# Altium schematic sheet 通讯转换模块-V6.SchDoc
size 635 x 635 mm
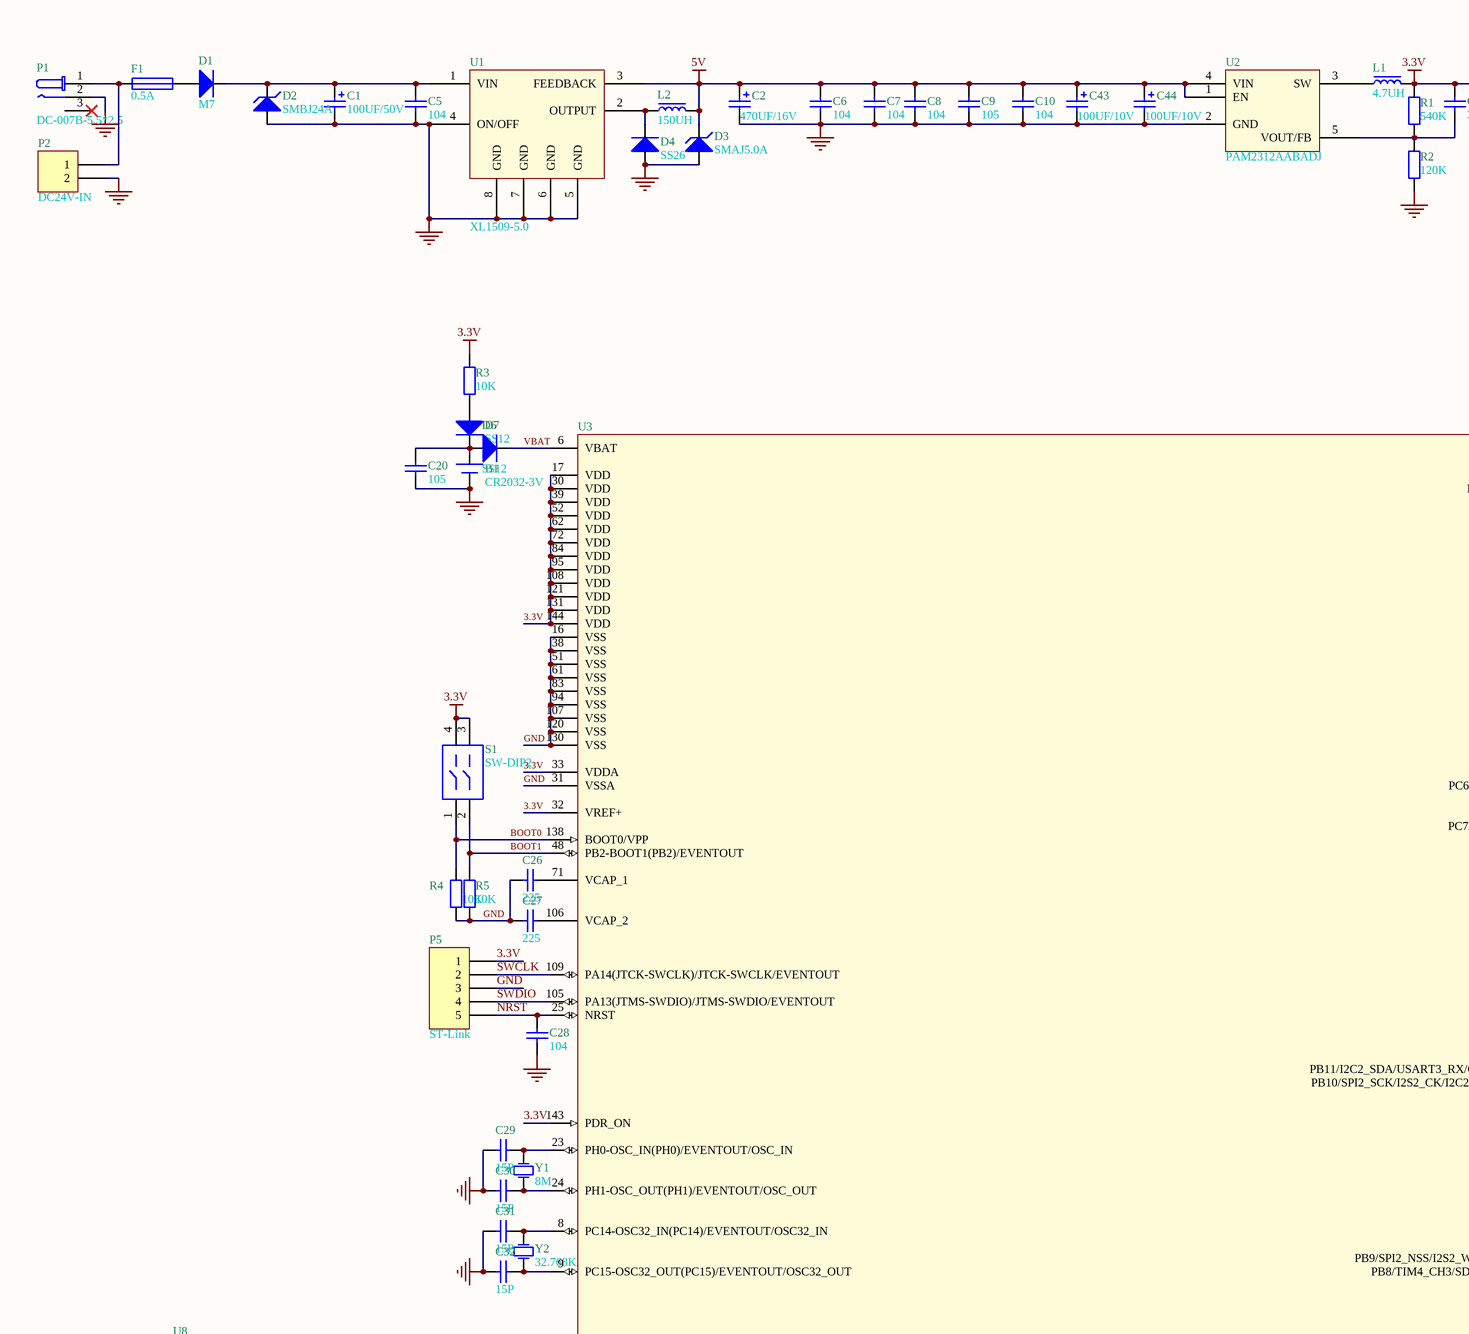
[diagram p0: 通讯转换模块-V6.SchDoc, top left]
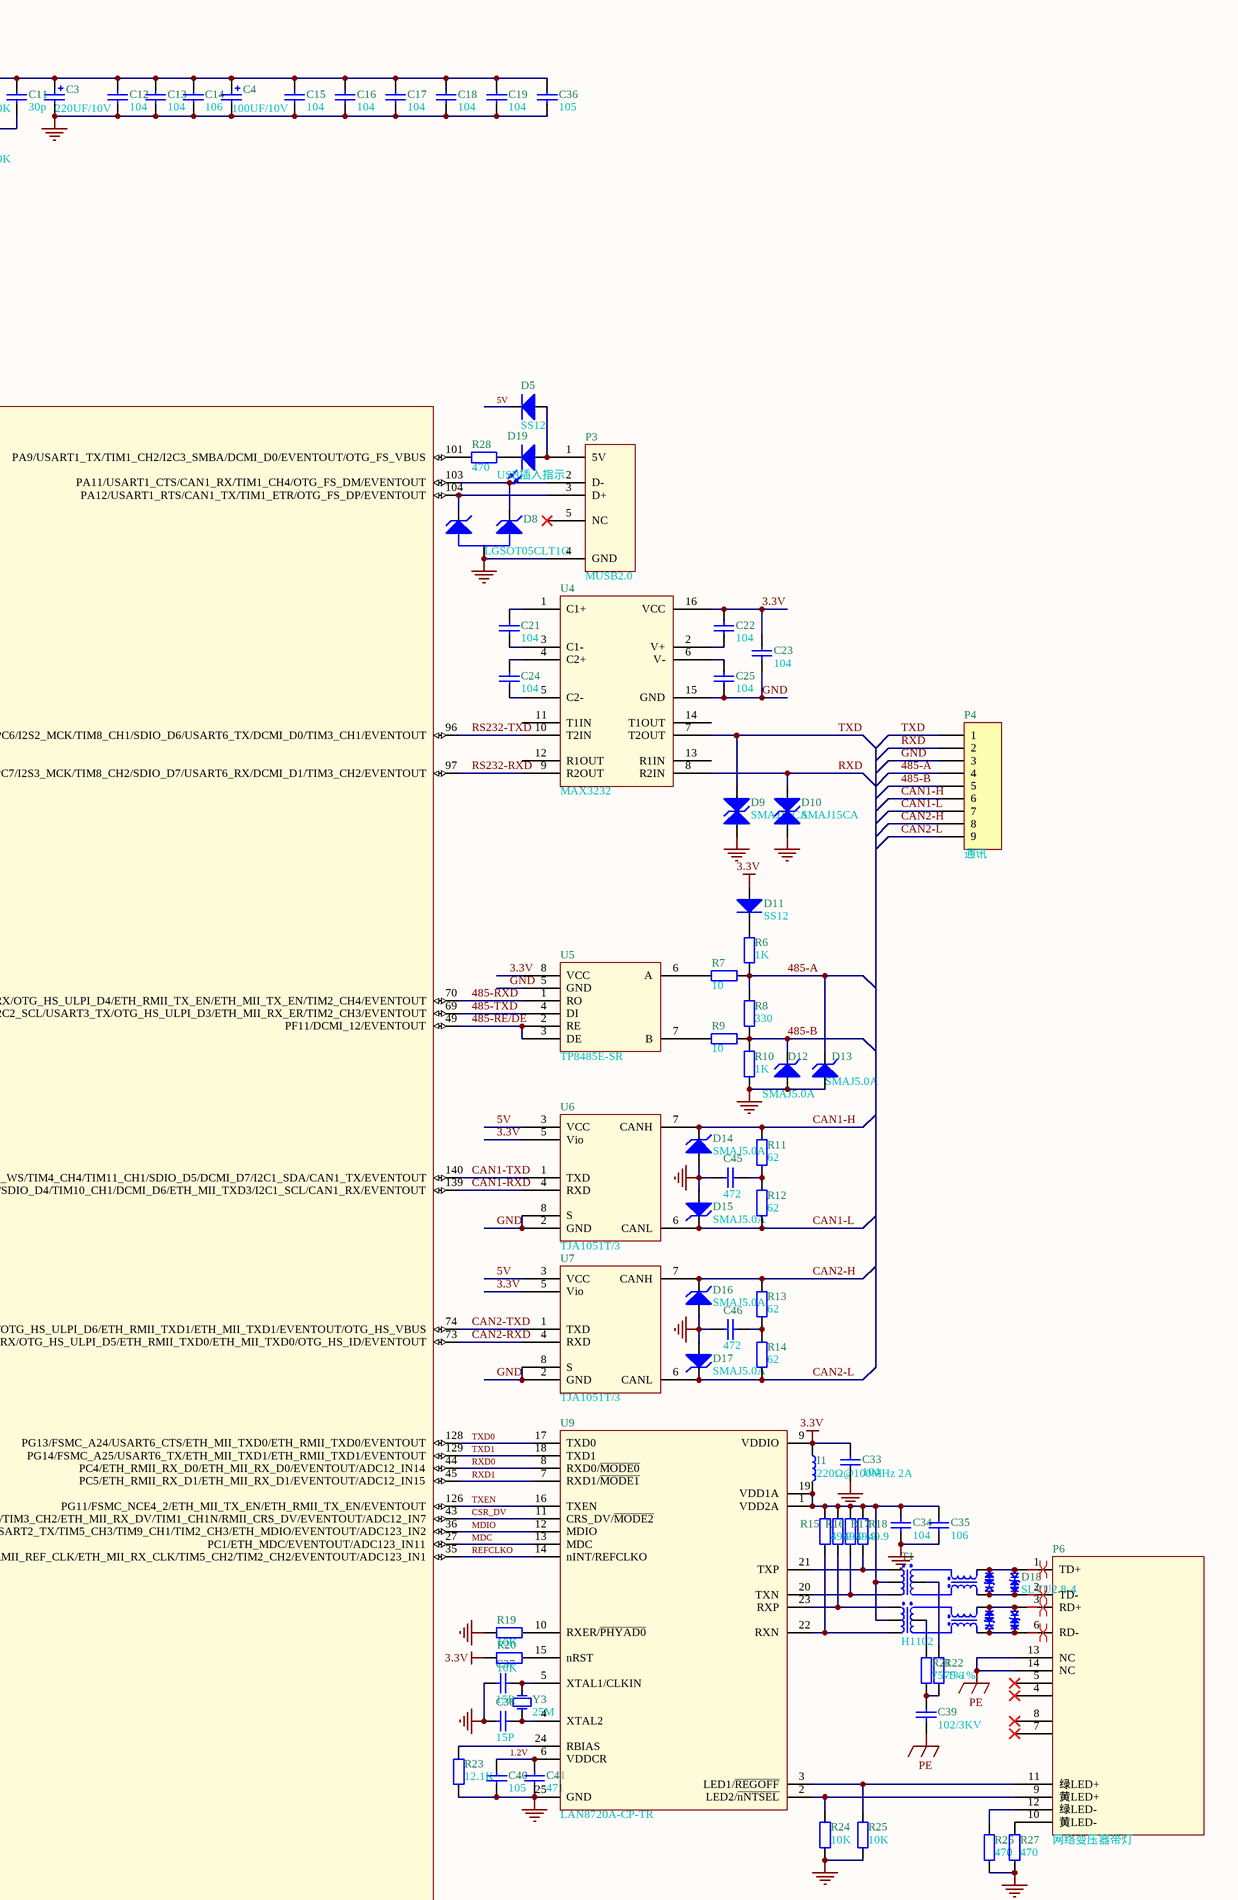
[diagram p1: 通讯转换模块-V6.SchDoc, top right]
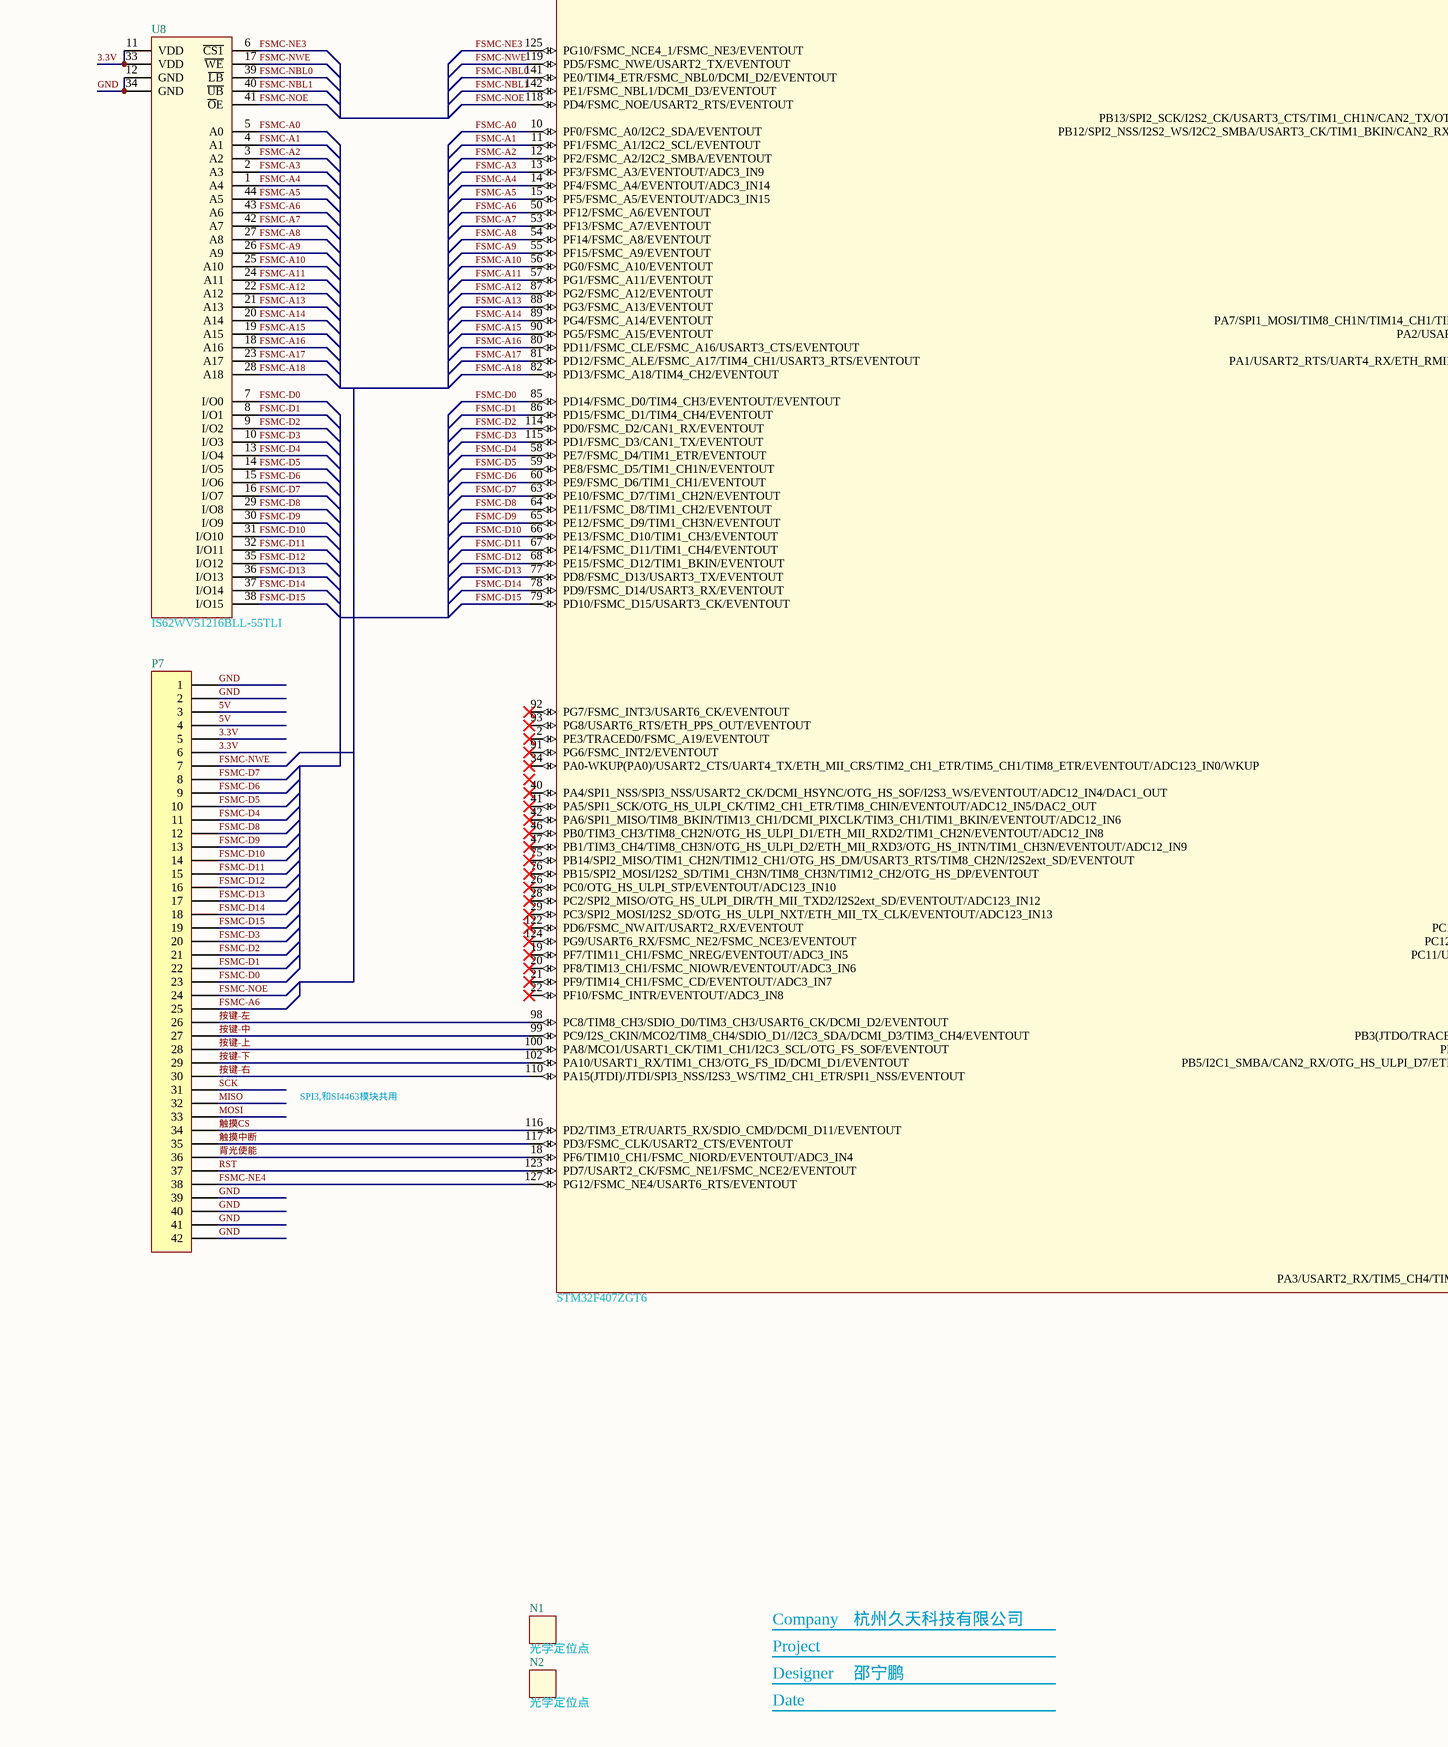
[diagram p2: 通讯转换模块-V6.SchDoc, bottom left]
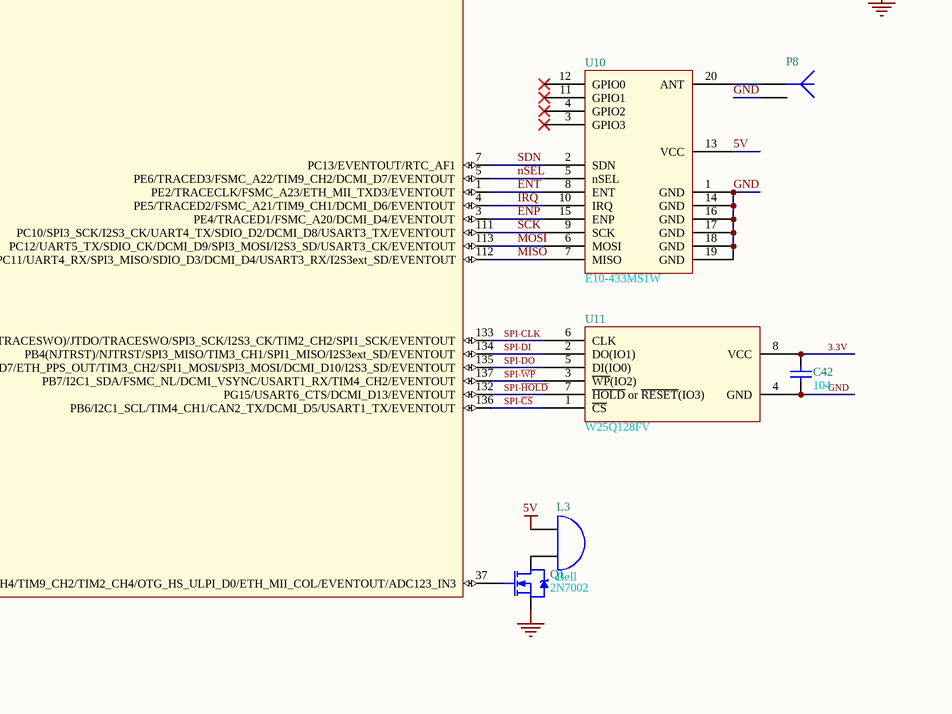
[diagram p3: 通讯转换模块-V6.SchDoc, bottom right]

## Parts
B1  CR2032-3V  [CR2032电池座-立式]
C1  100UF/50V  [贴片固态电容8*10]
C2  470UF/16V  [贴片固态电容8*10]
C3  220UF/10V  [贴片固态电容6.3*7.7]
C4  100UF/10V  [贴片固态电容5*5.3]
C5  104  [C-0603]
C6  104  [C-0603]
C7  104  [C-0603]
C8  104  [C-0603]
C9  105  [C-0603]
C10  104  [C-0603]
C11  30p  [C-0603]
C12  104  [C-0603]
C13  104  [C-0603]
C14  106  [C-0603]
C15  104  [C-0603]
C16  104  [C-0603]
C17  104  [C-0603]
C18  104  [C-0603]
C19  104  [C-0603]
C20  105  [C-0603]
C21  104  [C-0603]
C22  104  [C-0603]
C23  104  [C-0603]
C24  104  [C-0603]
C25  104  [C-0603]
C26  225  [C-0603]
C27  225  [C-0603]
C28  104  [C-0603]
C29  15P  [C-0603]
C30  15P  [C-0603]
C31  15P  [C-0603]
C32  15P  [C-0603]
C33  104  [C-0603]
C34  104  [C-0603]
C35  106  [C-0603]
C36  105  [C-0603]
C37  15P  [C-0603]
C38  15P  [C-0603]
C39  102/3KV  [C-1206]
C40  105  [C-0603]
C41  471  [C-0603]
C42  104  [C-0603]
C43  100UF/10V  [贴片固态电容5*5.3]
C44  100UF/10V  [贴片固态电容5*5.3]
C45  472  [C-0603]
C46  472  [C-0603]
D1  M7  [SMA]
D2  SMBJ24A  [SMB]
D3  SMAJ5.0A  [SMA]
D4  SS26  [SMA]
D5  SS12  [D-1206]
D6  SS12  [D-1206]
D7  SS12  [D-1206]
D8  LGSOT05CLT1G  [SOT-23]
D9  SMAJ15CA  [SMA无极性]
D10  SMAJ15CA  [SMA无极性]
D11  SS12  [D-1206]
D12  SMAJ5.0A  [SMA]
D13  SMAJ5.0A  [SMA]
D14  SMAJ5.0A  [SMA]
D15  SMAJ5.0A  [SMA]
D16  SMAJ5.0A  [SMA]
D17  SMAJ5.0A  [SMA]
D18  SLVU2.8-4  [SOP-8-N]
D19  USB插入指示  [LED-0603-Red]
F1  0.5A  [FUSE-1808]
I1  220Ω@100MHz 2A  [L-0805]
L1  4.7UH  [CD54]
L2  150UH  [CD75]
L3  Bell  [蜂鸣器 YH-8503-A]
N1  光学定位点  [MARK-1mm-3mm]
N2  光学定位点  [MARK-1mm-3mm]
P1  DC-007B-5.5*2.5  [DC-007B]
P2  DC24V-IN  [KF2EDG5.08V-2P-有挡边-卧式]
P3  MUSB2.0  [USB1.1-插件-母座]
P4  通讯  [KF2EDG5.08V-9P-有挡边-卧式]
P5  ST-Link  [HDR1X5]
P6  网络变压器带灯  [RJ45-8P8C-56带灯]
P7  (no value)  [FPC-0.5mm_40P下接翻盖]
P8  SMA-KWE  [SMA-KWE]  (value not drawn)
Q1  2N7002  [SOT-23]
R1  540K  [R-0603]
R2  120K  [R-0603]
R3  10K  [R-0603]
R4  10K  [R-0603]
R5  10K  [R-0603]
R6  1K  [R-0603]
R7  10  [R-0805]
R8  330  [R-1206]
R9  10  [R-0805]
R10  1K  [R-0603]
R11  62  [R-1206]
R12  62  [R-1206]
R13  62  [R-1206]
R14  62  [R-1206]
R15  49.9  [R-0603]
R16  49.9  [R-0603]
R17  49.9  [R-0603]
R18  49.9  [R-0603]
R19  10K  [R-0603]
R20  10K  [R-0603]
R21  75-1%  [R-0603]
R22  75-1%  [R-0603]
R23  12.1K  [R-0603]
R24  10K  [R-0603]
R25  10K  [R-0603]
R26  470  [R-0603]
R27  470  [R-0603]
R28  470  [R-0603]
S1  SW-DIP2  [SW-红色拨码开关2P]
T1  H1102  [H1102]
U1  XL1509-5.0  [SOP-8-N]
U2  PAM2312AABADJ  [SOT-23-5-M]
U3  STM32F407ZGT6  [TQFP-144-L]
U4  MAX3232  [SOP-16-N]
U5  TP8485E-SR  [SOP-8-N]
U6  TJA1051T/3  [SOP-8-N]
U7  TJA1051T/3  [SOP-8-N]
U8  IS62WV51216BLL-55TLI  [TSOP2-44-L]
U9  LAN8720A-CP-TR  [QFN-24]
U10  E10-433MS1W  [E10-433MS1W]
U11  W25Q128FV  [SOIC-8-M]
Y1  8M  [HC-49SMD]
Y2  32.768K  [FC135]
Y3  25M  [HC-49SMD]

## Nets
3.3V: C3.1 C4.1 C11.2 C12.2 C13.2 C14.2 C15.2 C16.2 C17.2 C18.2 C19.2 C22.2 C23.2 C33.2 C36.2 C42.2 D11.1(A) I1.2 L1.2 P5.1 P7.5 P7.6 R1.2 R3.2 R20.2 S1.3 S1.4 U3.17(VDD) U3.30(VDD) U3.32(VREF+) U3.33(VDDA) U3.39(VDD) U3.52(VDD) U3.62(VDD) U3.72(VDD) U3.84(VDD) U3.95(VDD) U3.108(VDD) U3.121(VDD) U3.131(VDD) U3.143(PDR_ON) U3.144(VDD) U4.16(VCC) U5.8(VCC) U6.5(Vio) U7.5(Vio) U8.11(VDD) U8.33(VDD) U9.9(VDDIO) U11.8(VCC)
5V: C2.1 C6.2 C7.2 C8.2 C9.2 C10.2 C43.1 C44.1 D3.2(K) D5.2(K) L2.2 L3.1(A) P7.3 P7.4 U1.3(FEEDBACK) U2.1(EN) U2.4(VIN) U6.3(VCC) U7.3(VCC) U10.13(VCC)
GND: B1.2(-) C1.2 C2.2 C3.2 C4.2 C5.1 C6.1 C7.1 C8.1 C9.1 C10.1 C12.1 C13.1 C14.1 C15.1 C16.1 C17.1 C18.1 C19.1 C20.1 C23.1 C25.1 C26.1 C27.1 C28.1 C29.2 C30.2 C31.2 C32.2 C33.1 C34.1 C35.1 C36.1 C37.2 C38.2 C40.1 C41.1 C42.1 C43.2 C44.2 C45.1 C46.1 D2.1(A) D3.1(A) D4.1(A) D8.3(A) D9.1(A) D10.1(A) D12.1(A) D13.1(A) D14.1(A) D15.1(A) D16.1(A) D17.1(A) P1.2 P2.2 P3.4(GND) P4.3 P5.3 P7.1 P7.2 P7.39 P7.40 P7.41 P7.42 P8.2 Q1.2(S) R2.1 R4.1 R5.1 R10.1 R19.2 R23.2 R24.2 R25.2 R26.1 R27.2 U1.4(ON/OFF) U1.5(GND) U1.6(GND) U1.7(GND) U1.8(GND) U2.2(GND) U3.16(VSS) U3.31(VSSA) U3.38(VSS) U3.51(VSS) U3.61(VSS) U3.83(VSS) U3.94(VSS) U3.107(VSS) U3.120(VSS) U3.130(VSS) U4.15(GND) U5.5(GND) U6.2(GND) U6.8(S) U7.2(GND) U7.8(S) U8.12(GND) U8.34(GND) U9.25(GND) U10.1(GND) U10.14(GND) U10.16(GND) U10.17(GND) U10.18(GND) U10.19(GND) U11.4(GND)
PE: C39.2 P6.13(NC) P6.14(NC)
1.2V: C40.2 C41.2 U9.6(VDDCR)
485-A: D13.2(K) P4.4 R6.2 R7.1 R8.1
485-B: D12.2(K) P4.5 R8.2 R9.1 R10.2
485-RE/DE: U3.49(PF11/DCMI_12/EVENTOUT) U5.2(RE) U5.3(DE)
485-RXD: U3.70(PB11/I2C2_SDA/USART3_RX/OTG_HS_ULPI_D4/ETH_RMII_TX_EN/ETH_MII_TX_EN/TIM2_CH4/EVENTOUT) U5.1(RO)
485-TXD: U3.69(PB10/SPI2_SCK/I2S2_CK/I2C2_SCL/USART3_TX/OTG_HS_ULPI_D3/ETH_MII_RX_ER/TIM2_CH3/EVENTOUT) U5.4(DI)
BOOT0: R4.2 S1.1 U3.138(BOOT0/VPP)
BOOT1: R5.2 S1.2 U3.48(PB2-BOOT1(PB2)/EVENTOUT)
CAN1-H: D14.2(K) P4.6 R11.1 U6.7(CANH)
CAN1-L: D15.2(K) P4.7 R12.2 U6.6(CANL)
CAN1-RXD: U3.139(PB8/TIM4_CH3/SDIO_D4/TIM10_CH1/DCMI_D6/ETH_MII_TXD3/I2C1_SCL/CAN1_RX/EVENTOUT) U6.4(RXD)
CAN1-TXD: U3.140(PB9/SPI2_NSS/I2S2_WS/TIM4_CH4/TIM11_CH1/SDIO_D5/DCMI_D7/I2C1_SDA/CAN1_TX/EVENTOUT) U6.1(TXD)
CAN2-H: D16.2(K) P4.8 R13.1 U7.7(CANH)
CAN2-L: D17.2(K) P4.9 R14.2 U7.6(CANL)
CAN2-RXD: U3.73(PB12/SPI2_NSS/I2S2_WS/I2C2_SMBA/USART3_CK/TIM1_BKIN/CAN2_RX/OTG_HS_ULPI_D5/ETH_RMII_TXD0/ETH_MII_TXD0/OTG_HS_ID/EVENTOUT) U7.4(RXD)
CAN2-TXD: U3.74(PB13/SPI2_SCK/I2S2_CK/USART3_CTS/TIM1_CH1N/CAN2_TX/OTG_HS_ULPI_D6/ETH_RMII_TXD1/ETH_MII_TXD1/EVENTOUT/OTG_HS_VBUS) U7.1(TXD)
CSR_DV: U3.43(PA7/SPI1_MOSI/TIM8_CH1N/TIM14_CH1/TIM3_CH2/ETH_MII_RX_DV/TIM1_CH1N/RMII_CRS_DV/EVENTOUT/ADC12_IN7) U9.11(CRS_DV/~{MODE2})
ENP: U3.3(PE4/TRACED1/FSMC_A20/DCMI_D4/EVENTOUT) U10.15(ENP)
ENT: U3.1(PE2/TRACECLK/FSMC_A23/ETH_MII_TXD3/EVENTOUT) U10.8(ENT)
FSMC-A0: U3.10(PF0/FSMC_A0/I2C2_SDA/EVENTOUT) U8.5(A0)
FSMC-A1: U3.11(PF1/FSMC_A1/I2C2_SCL/EVENTOUT) U8.4(A1)
FSMC-A2: U3.12(PF2/FSMC_A2/I2C2_SMBA/EVENTOUT) U8.3(A2)
FSMC-A3: U3.13(PF3/FSMC_A3/EVENTOUT/ADC3_IN9) U8.2(A3)
FSMC-A4: U3.14(PF4/FSMC_A4/EVENTOUT/ADC3_IN14) U8.1(A4)
FSMC-A5: U3.15(PF5/FSMC_A5/EVENTOUT/ADC3_IN15) U8.44(A5)
FSMC-A6: P7.25 U3.50(PF12/FSMC_A6/EVENTOUT) U8.43(A6)
FSMC-A7: U3.53(PF13/FSMC_A7/EVENTOUT) U8.42(A7)
FSMC-A8: U3.54(PF14/FSMC_A8/EVENTOUT) U8.27(A8)
FSMC-A9: U3.55(PF15/FSMC_A9/EVENTOUT) U8.26(A9)
FSMC-A10: U3.56(PG0/FSMC_A10/EVENTOUT) U8.25(A10)
FSMC-A11: U3.57(PG1/FSMC_A11/EVENTOUT) U8.24(A11)
FSMC-A12: U3.87(PG2/FSMC_A12/EVENTOUT) U8.22(A12)
FSMC-A13: U3.88(PG3/FSMC_A13/EVENTOUT) U8.21(A13)
FSMC-A14: U3.89(PG4/FSMC_A14/EVENTOUT) U8.20(A14)
FSMC-A15: U3.90(PG5/FSMC_A15/EVENTOUT) U8.19(A15)
FSMC-A16: U3.80(PD11/FSMC_CLE/FSMC_A16/USART3_CTS/EVENTOUT) U8.18(A16)
FSMC-A17: U3.81(PD12/FSMC_ALE/FSMC_A17/TIM4_CH1/USART3_RTS/EVENTOUT) U8.23(A17)
FSMC-A18: U3.82(PD13/FSMC_A18/TIM4_CH2/EVENTOUT) U8.28(A18)
FSMC-D0: P7.23 U3.85(PD14/FSMC_D0/TIM4_CH3/EVENTOUT/EVENTOUT) U8.7(I/O0)
FSMC-D1: P7.22 U3.86(PD15/FSMC_D1/TIM4_CH4/EVENTOUT) U8.8(I/O1)
FSMC-D2: P7.21 U3.114(PD0/FSMC_D2/CAN1_RX/EVENTOUT) U8.9(I/O2)
FSMC-D3: P7.20 U3.115(PD1/FSMC_D3/CAN1_TX/EVENTOUT) U8.10(I/O3)
FSMC-D4: P7.11 U3.58(PE7/FSMC_D4/TIM1_ETR/EVENTOUT) U8.13(I/O4)
FSMC-D5: P7.10 U3.59(PE8/FSMC_D5/TIM1_CH1N/EVENTOUT) U8.14(I/O5)
FSMC-D6: P7.9 U3.60(PE9/FSMC_D6/TIM1_CH1/EVENTOUT) U8.15(I/O6)
FSMC-D7: P7.8 U3.63(PE10/FSMC_D7/TIM1_CH2N/EVENTOUT) U8.16(I/O7)
FSMC-D8: P7.12 U3.64(PE11/FSMC_D8/TIM1_CH2/EVENTOUT) U8.29(I/O8)
FSMC-D9: P7.13 U3.65(PE12/FSMC_D9/TIM1_CH3N/EVENTOUT) U8.30(I/O9)
FSMC-D10: P7.14 U3.66(PE13/FSMC_D10/TIM1_CH3/EVENTOUT) U8.31(I/O10)
FSMC-D11: P7.15 U3.67(PE14/FSMC_D11/TIM1_CH4/EVENTOUT) U8.32(I/O11)
FSMC-D12: P7.16 U3.68(PE15/FSMC_D12/TIM1_BKIN/EVENTOUT) U8.35(I/O12)
FSMC-D13: P7.17 U3.77(PD8/FSMC_D13/USART3_TX/EVENTOUT) U8.36(I/O13)
FSMC-D14: P7.18 U3.78(PD9/FSMC_D14/USART3_RX/EVENTOUT) U8.37(I/O14)
FSMC-D15: P7.19 U3.79(PD10/FSMC_D15/USART3_CK/EVENTOUT) U8.38(I/O15)
FSMC-NBL0: U3.141(PE0/TIM4_ETR/FSMC_NBL0/DCMI_D2/EVENTOUT) U8.39(~{LB})
FSMC-NBL1: U3.142(PE1/FSMC_NBL1/DCMI_D3/EVENTOUT) U8.40(~{UB})
FSMC-NE3: U3.125(PG10/FSMC_NCE4_1/FSMC_NE3/EVENTOUT) U8.6(~{CS1})
FSMC-NE4: P7.38 U3.127(PG12/FSMC_NE4/USART6_RTS/EVENTOUT)
FSMC-NOE: P7.24 U3.118(PD4/FSMC_NOE/USART2_RTS/EVENTOUT) U8.41(~{O}E)
FSMC-NWE: P7.7 U3.119(PD5/FSMC_NWE/USART2_TX/EVENTOUT) U8.17(~{WE})
IRQ: U3.4(PE5/TRACED2/FSMC_A21/TIM9_CH1/DCMI_D6/EVENTOUT) U10.10(IRQ)
MDC: U3.27(PC1/ETH_MDC/EVENTOUT/ADC123_IN11) U9.13(MDC)
MDIO: U3.36(PA2/USART2_TX/TIM5_CH3/TIM9_CH1/TIM2_CH3/ETH_MDIO/EVENTOUT/ADC123_IN2) U9.12(MDIO)
MISO: P7.32 U3.112(PC11/UART4_RX/SPI3_MISO/SDIO_D3/DCMI_D4/USART3_RX/I2S3ext_SD/EVENTOUT) U10.7(MISO)
MOSI: P7.33 U3.113(PC12/UART5_TX/SDIO_CK/DCMI_D9/SPI3_MOSI/I2S3_SD/USART3_CK/EVENTOUT) U10.6(MOSI)
NRST: C28.2 P5.5 U3.25(NRST)
nSEL: U3.5(PE6/TRACED3/FSMC_A22/TIM9_CH2/DCMI_D7/EVENTOUT) U10.5(nSEL)
REFCLKO: U3.35(PA1/USART2_RTS/UART4_RX/ETH_RMII_REF_CLK/ETH_MII_RX_CLK/TIM5_CH2/TIM2_CH2/EVENTOUT/ADC123_IN1) U9.14(nINT/REFCLKO)
RS232-RXD: U3.97(PC7/I2S3_MCK/TIM8_CH2/SDIO_D7/USART6_RX/DCMI_D1/TIM3_CH2/EVENTOUT) U4.9(R2OUT)
RS232-TXD: U3.96(PC6/I2S2_MCK/TIM8_CH1/SDIO_D6/USART6_TX/DCMI_D0/TIM3_CH1/EVENTOUT) U4.10(T2IN)
RST: P7.37 U3.123(PD7/USART2_CK/FSMC_NE1/FSMC_NCE2/EVENTOUT)
RXD: D10.2(K) P4.2 U4.8(R2IN)
RXD0: U3.44(PC4/ETH_RMII_RX_D0/ETH_MII_RX_D0/EVENTOUT/ADC12_IN14) U9.8(RXD0/~{MODE0})
RXD1: U3.45(PC5/ETH_RMII_RX_D1/ETH_MII_RX_D1/EVENTOUT/ADC12_IN15) U9.7(RXD1/~{MODE1})
SCK: P7.31 U3.111(PC10/SPI3_SCK/I2S3_CK/UART4_TX/SDIO_D2/DCMI_D8/USART3_TX/EVENTOUT) U10.9(SCK)
SDN: U3.7(PC13/EVENTOUT/RTC_AF1) U10.2(SDN)
SPI-~{CS}: U3.136(PB6/I2C1_SCL/TIM4_CH1/CAN2_TX/DCMI_D5/USART1_TX/EVENTOUT) U11.1(~{CS})
SPI-CLK: U3.133(PB3(JTDO/TRACESWO)/JTDO/TRACESWO/SPI3_SCK/I2S3_CK/TIM2_CH2/SPI1_SCK/EVENTOUT) U11.6(CLK)
SPI-DI: U3.134(PB4(NJTRST)/NJTRST/SPI3_MISO/TIM3_CH1/SPI1_MISO/I2S3ext_SD/EVENTOUT) U11.2(DO(IO1))
SPI-DO: U3.135(PB5/I2C1_SMBA/CAN2_RX/OTG_HS_ULPI_D7/ETH_PPS_OUT/TIM3_CH2/SPI1_MOSI/SPI3_MOSI/DCMI_D10/I2S3_SD/EVENTOUT) U11.5(DI(IO0))
SPI-~{HOLD}: U3.132(PG15/USART6_CTS/DCMI_D13/EVENTOUT) U11.7(~{HOLD}_or_~{RESET}(IO3))
SPI-~{WP}: U3.137(PB7/I2C1_SDA/FSMC_NL/DCMI_VSYNC/USART1_RX/TIM4_CH2/EVENTOUT) U11.3(~{WP}(IO2))
SWCLK: P5.2 U3.109(PA14(JTCK-SWCLK)/JTCK-SWCLK/EVENTOUT)
SWDIO: P5.4 U3.105(PA13(JTMS-SWDIO)/JTMS-SWDIO/EVENTOUT)
TXD: D9.2(K) P4.1 U4.7(T2OUT)
TXD0: U3.128(PG13/FSMC_A24/USART6_CTS/ETH_MII_TXD0/ETH_RMII_TXD0/EVENTOUT) U9.17(TXD0)
TXD1: U3.129(PG14/FSMC_A25/USART6_TX/ETH_MII_TXD1/ETH_RMII_TXD1/EVENTOUT) U9.18(TXD1)
TXEN: U3.126(PG11/FSMC_NCE4_2/ETH_MII_TX_EN/ETH_RMII_TX_EN/EVENTOUT) U9.16(TXEN)
VBAT: D6.2(K) U3.6(VBAT)
按键-上: P7.28 U3.100(PA8/MCO1/USART1_CK/TIM1_CH1/I2C3_SCL/OTG_FS_SOF/EVENTOUT)
按键-下: P7.29 U3.102(PA10/USART1_RX/TIM1_CH3/OTG_FS_ID/DCMI_D1/EVENTOUT)
按键-中: P7.27 U3.99(PC9/I2S_CKIN/MCO2/TIM8_CH4/SDIO_D1//I2C3_SDA/DCMI_D3/TIM3_CH4/EVENTOUT)
按键-右: P7.30 U3.110(PA15(JTDI)/JTDI/SPI3_NSS/I2S3_WS/TIM2_CH1_ETR/SPI1_NSS/EVENTOUT)
按键-左: P7.26 U3.98(PC8/TIM8_CH3/SDIO_D0/TIM3_CH3/USART6_CK/DCMI_D2/EVENTOUT)
背光使能: P7.36 U3.18(PF6/TIM10_CH1/FSMC_NIORD/EVENTOUT/ADC3_IN4)
触摸CS: P7.34 U3.116(PD2/TIM3_ETR/UART5_RX/SDIO_CMD/DCMI_D11/EVENTOUT)
触摸中断: P7.35 U3.117(PD3/FSMC_CLK/USART2_CTS/EVENTOUT)
NetB1_1: B1.1(+) C20.2 D6.1(A) D7.2(K)
NetC1_1: C1.1 C5.2 D1.2(K) D2.2(K) U1.1(VIN)
NetC11_1: C11.1 R1.1 R2.2 U2.5(VOUT/FB)
NetC21_1: C21.1 U4.3(C1-)
NetC21_2: C21.2 U4.1(C1+)
NetC22_1: C22.1 U4.2(V+)
NetC24_1: C24.1 U4.5(C2-)
NetC24_2: C24.2 U4.4(C2+)
NetC25_2: C25.2 U4.6(V-)
NetC26_2: C26.2 U3.71(VCAP_1)
NetC27_2: C27.2 U3.106(VCAP_2)
NetC29_1: C29.1 U3.23(PH0-OSC_IN(PH0)/EVENTOUT/OSC_IN) Y1.2(OSC2)
NetC30_1: C30.1 U3.24(PH1-OSC_OUT(PH1)/EVENTOUT/OSC_OUT) Y1.1(OSC1)
NetC31_1: C31.1 U3.8(PC14-OSC32_IN(PC14)/EVENTOUT/OSC32_IN) Y2.2(OSC2)
NetC32_1: C32.1 U3.9(PC15-OSC32_OUT(PC15)/EVENTOUT/OSC32_OUT) Y2.1(OSC1)
NetC34_2: C34.2 C35.2 I1.1 R15.2 R16.2 R17.2 R18.2 T1.2 T1.7 U9.1(VDD2A) U9.19(VDD1A)
NetC37_1: C37.1 U9.5(XTAL1/CLKIN) Y3.2(OSC2)
NetC38_1: C38.1 U9.4(XTAL2) Y3.1(OSC1)
NetC39_1: C39.1 R21.2 R22.1
NetC45_2: C45.2 R11.2 R12.1
NetC46_2: C46.2 R13.2 R14.1
NetD1_1: D1.1(A) F1.2
NetD4_2: D4.2(K) L2.1 U1.2(OUTPUT)
NetD5_1: D5.1(A) D19.1(A) P3.1(5V)
NetD7_1: D7.1(A) R3.1
NetD8_1: D8.1(K) P3.3(D+) U3.104(PA12/USART1_RTS/CAN1_TX/TIM1_ETR/OTG_FS_DP/EVENTOUT)
NetD8_2: D8.2(K) P3.2(D-) U3.103(PA11/USART1_CTS/CAN1_RX/TIM1_CH4/OTG_FS_DM/EVENTOUT)
NetD11_2: D11.2(K) R6.1
NetD18_1: D18.1 D18.8 P6.1(TD+) T1.16
NetD18_2: D18.2 D18.7 P6.2(TD-) T1.14
NetD18_3: D18.3 D18.6 P6.3(RD+) T1.11
NetD18_4: D18.4 D18.5 P6.6(RD-) T1.9
NetD19_2: D19.2(K) R28.1
NetF1_1: F1.1 P1.1 P2.1
NetL1_1: L1.1 U2.3(SW)
NetL3_2: L3.2(B) Q1.3(D)
NetP6_9: P6.9(黄LED+) R24.1 U9.2(LED2/~{nNTSEL})
NetP6_10: P6.10(黄LED-) R27.1
NetP6_11: P6.11(绿LED+) R25.1 U9.3(LED1/~{REGOFF})
NetP6_12: P6.12(绿LED-) R26.2
NetP8_1: P8.1 U10.20(ANT)
NetQ1_1: Q1.1(G) U3.37(PA3/USART2_RX/TIM5_CH4/TIM9_CH2/TIM2_CH4/OTG_HS_ULPI_D0/ETH_MII_COL/EVENTOUT/ADC123_IN3)
NetR7_2: R7.2 U5.6(A)
NetR9_2: R9.2 U5.7(B)
NetR15_1: R15.1 T1.8 U9.22(RXN)
NetR16_1: R16.1 T1.6 U9.23(RXP)
NetR17_1: R17.1 T1.3 U9.20(TXN)
NetR18_1: R18.1 T1.1 U9.21(TXP)
NetR19_1: R19.1 U9.10(RXER/~{PHYAD0})
NetR20_1: R20.1 U9.15(nRST)
NetR21_1: R21.1 T1.10
NetR22_2: R22.2 T1.15
NetR23_1: R23.1 U9.24(RBIAS)
NetR28_2: R28.2 U3.101(PA9/USART1_TX/TIM1_CH2/I2C3_SMBA/DCMI_D0/EVENTOUT/OTG_FS_VBUS)

Not connected (* = marked no-connect by the designer): P1 3(NC)*; P3 5(NC)*; P6 4* 5* 7* 8*; U3 2(PE3/TRACED0/FSMC_A19/EVENTOUT)* 19(PF7/TIM11_CH1/FSMC_NREG/EVENTOUT/ADC3_IN5)* 20(PF8/TIM13_CH1/FSMC_NIOWR/EVENTOUT/ADC3_IN6)* 21(PF9/TIM14_CH1/FSMC_CD/EVENTOUT/ADC3_IN7)* 22(PF10/FSMC_INTR/EVENTOUT/ADC3_IN8)* 26(PC0/OTG_HS_ULPI_STP/EVENTOUT/ADC123_IN10)* 28(PC2/SPI2_MISO/OTG_HS_ULPI_DIR/TH_MII_TXD2/I2S2ext_SD/EVENTOUT/ADC123_IN12)* 29(PC3/SPI2_MOSI/I2S2_SD/OTG_HS_ULPI_NXT/ETH_MII_TX_CLK/EVENTOUT/ADC123_IN13)* 34(PA0-WKUP(PA0)/USART2_CTS/UART4_TX/ETH_MII_CRS/TIM2_CH1_ETR/TIM5_CH1/TIM8_ETR/EVENTOUT/ADC123_IN0/WKUP)* 40(PA4/SPI1_NSS/SPI3_NSS/USART2_CK/DCMI_HSYNC/OTG_HS_SOF/I2S3_WS/EVENTOUT/ADC12_IN4/DAC1_OUT)* 41(PA5/SPI1_SCK/OTG_HS_ULPI_CK/TIM2_CH1_ETR/TIM8_CHIN/EVENTOUT/ADC12_IN5/DAC2_OUT)* 42(PA6/SPI1_MISO/TIM8_BKIN/TIM13_CH1/DCMI_PIXCLK/TIM3_CH1/TIM1_BKIN/EVENTOUT/ADC12_IN6)* 46(PB0/TIM3_CH3/TIM8_CH2N/OTG_HS_ULPI_D1/ETH_MII_RXD2/TIM1_CH2N/EVENTOUT/ADC12_IN8)* 47(PB1/TIM3_CH4/TIM8_CH3N/OTG_HS_ULPI_D2/ETH_MII_RXD3/OTG_HS_INTN/TIM1_CH3N/EVENTOUT/ADC12_IN9)* 75(PB14/SPI2_MISO/TIM1_CH2N/TIM12_CH1/OTG_HS_DM/USART3_RTS/TIM8_CH2N/I2S2ext_SD/EVENTOUT)* 76(PB15/SPI2_MOSI/I2S2_SD/TIM1_CH3N/TIM8_CH3N/TIM12_CH2/OTG_HS_DP/EVENTOUT)* 91(PG6/FSMC_INT2/EVENTOUT)* 92(PG7/FSMC_INT3/USART6_CK/EVENTOUT)* 93(PG8/USART6_RTS/ETH_PPS_OUT/EVENTOUT)* 122(PD6/FSMC_NWAIT/USART2_RX/EVENTOUT)* 124(PG9/USART6_RX/FSMC_NE2/FSMC_NCE3/EVENTOUT)*; U4 11(T1IN) 12(R1OUT) 13(R1IN) 14(T1OUT); U10 3(GPIO3)* 4(GPIO2)* 11(GPIO1)* 12(GPIO0)*

## Layout directives
differential pair: (no net found under the mark)

## Notes on the sheet
- SPI3,和SI4463模块共用
- Project
- Company
- 杭州久天科技有限公司
- Designer
- Date
- 邵宁鹏

## Library data of the parts
B1 = Battery1: 锂电池
C1-C4 C43 C44 = Cap Pol1: 电解电容; Published: 8-Jun-2000; LatestRevisionDate: 17-Jul-2002; LatestRevisionNote: Re-released for DXP Platform.; PackageReference: RB7.6-15; Publisher: Altium Limited
C5-C19 C21-C25 C39 = Cap-0805: 0805; Published: 8-Jun-2000; LatestRevisionDate: 17-Jul-2002; LatestRevisionNote: Re-released for DXP Platform.; PackageReference: RAD-0.3; Publisher: Altium Limited
C20 C26-C38 C40-C42 C45 C46 = Cap-0603: 0805; Published: 8-Jun-2000; LatestRevisionDate: 17-Jul-2002; LatestRevisionNote: Re-released for DXP Platform.; PackageReference: RAD-0.3; Publisher: Altium Limited
D1 = M7: SMA; Published: 8-Jun-2000; LatestRevisionDate: 17-Jul-2002; LatestRevisionNote: Re-released for DXP Platform.; DatasheetVersion: 1989; PackageVersion: 1989; PackageReference: DO-35A; Publisher: Altium Limited; Code_JEDEC: DO-204-AH; ComponentLink1Description: Manufacturer Link; ComponentLink1URL: http://www.national.com/
D2 D3 D12-D17 = TVS-1: SMB
D4-D7 D11 = SS14: SMA
D8 = ESDA5V3L: ESD
D9 D10 = TVS-2: SMB
D19 = LED-0603-Blue: Published: 8-Jun-2000; LatestRevisionDate: 08-Jul-2005; LatestRevisionNote: Mech Layer 1 removed.; PackageReference: LED-0; Publisher: Altium Limited
F1 = Fuse 1: Fuse; Published: 8-Jun-2000; LatestRevisionDate: 17-Jul-2002; LatestRevisionNote: Re-released for DXP Platform.; PackageReference: PIN-W2/E2.8; Publisher: Altium Limited
I1 = Inductance1
L1 L2 = Inductance3
L3 = Bell: Electrical Bell; Published: 24-Mar-1999; LatestRevisionDate: 17-Jul-2002; LatestRevisionNote: Re-released for DXP Platform.; PackageReference: PIN2; Publisher: Altium Limited
N1 N2 = 无引脚
P1 = DC-007B
P2 = Header 2: Header, 2-Pin; LatestRevisionDate: 17-Jul-2002; LatestRevisionNote: Re-released for DXP Platform.; Publisher: Altium Limited
P3 = USB-4_A
P4 = Header 9: Header, 9-Pin; LatestRevisionDate: 17-Jul-2002; LatestRevisionNote: Re-released for DXP Platform.; Publisher: Altium Limited
P5 = Header 5: Header, 5-Pin; LatestRevisionDate: 17-Jul-2002; LatestRevisionNote: Re-released for DXP Platform.; Publisher: Altium Limited
P7 = MHDR1X42
P8 = 天线座
R1-R5 R19 R20 R23-R28 = Res2-0603: 0603; Published: 8-Jun-2000; LatestRevisionDate: 17-Jul-2002; LatestRevisionNote: Re-released for DXP Platform.; PackageReference: AXIAL-0.4; Publisher: Altium Limited
R6 R10 R15-R18 = Res2: Resistor; Published: 8-Jun-2000; LatestRevisionDate: 17-Jul-2002; LatestRevisionNote: Re-released for DXP Platform.; PackageReference: AXIAL-0.4; Publisher: Altium Limited
R7-R9 R11-R14 = Res2: Resistor; Value: 1K; Published: 8-Jun-2000; LatestRevisionDate: 17-Jul-2002; LatestRevisionNote: Re-released for DXP Platform.; PackageReference: AXIAL-0.4; Publisher: Altium Limited
R21 R22 = Res2-0805: 0805; Published: 8-Jun-2000; LatestRevisionDate: 17-Jul-2002; LatestRevisionNote: Re-released for DXP Platform.; PackageReference: AXIAL-0.4; Publisher: Altium Limited
U1 = XL1509-ADJ: 开关电源 SOP-8
U2 = PAM2312: 开关电源 SOT-23-5
U3 = STM32F407ZET6
U5 = MAX3082: RS485总线转串口
U9 = LAN8720A-CP-TR: 以太网PHY
U10 = E10-433MS1W: 433模块
U11 = W25Q128FV: SPI-FLASH
Y1-Y3 = 晶振
S1 = SW-DIP2: Published: 24-Mar-1999; LatestRevisionDate: 17-Dec-2003; LatestRevisionNote: PCB Footprint replaced.; PackageReference: DIP-16-KEY; Publisher: Altium Limited; ComponentLink1Description: Manufacturer Link; ComponentLink1URL: http://www.oupiin.com/prodindx.html#Headers